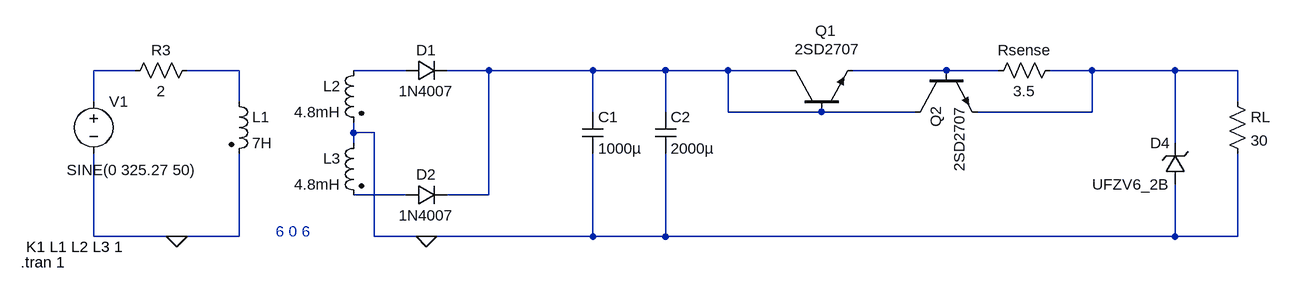
[diagram p0: schematic MP01_P.asc]
MP01_P.asc, the LTspice schematic file:
Version 4
SHEET 1 2204 680
WIRE 208 64 144 64
WIRE 368 64 288 64
WIRE 624 64 544 64
WIRE 752 64 688 64
WIRE 912 64 752 64
WIRE 1024 64 912 64
WIRE 1120 64 1024 64
WIRE 1216 64 1120 64
WIRE 1456 64 1312 64
WIRE 1536 64 1456 64
WIRE 1680 64 1616 64
WIRE 1808 64 1680 64
WIRE 1904 64 1808 64
WIRE 144 112 144 64
WIRE 368 112 368 64
WIRE 1904 112 1904 64
WIRE 912 128 912 64
WIRE 1024 128 1024 64
WIRE 1120 128 1120 64
WIRE 1264 128 1120 128
WIRE 1408 128 1264 128
WIRE 1680 128 1680 64
WIRE 1680 128 1504 128
WIRE 544 160 544 144
WIRE 576 160 544 160
WIRE 544 176 544 160
WIRE 1808 176 1808 64
WIRE 624 256 544 256
WIRE 752 256 752 64
WIRE 752 256 688 256
WIRE 144 320 144 192
WIRE 272 320 144 320
WIRE 368 320 368 192
WIRE 368 320 272 320
WIRE 576 320 576 160
WIRE 656 320 576 320
WIRE 912 320 912 192
WIRE 912 320 656 320
WIRE 1024 320 1024 192
WIRE 1024 320 912 320
WIRE 1808 320 1808 240
WIRE 1808 320 1024 320
WIRE 1904 320 1904 192
WIRE 1904 320 1808 320
FLAG 656 320 0
FLAG 272 320 0
SYMBOL voltage 144 96 R0
WINDOW 3 -41 121 Left 2
WINDOW 123 0 0 Left 0
WINDOW 39 -44 143 Left 2
SYMATTR Value SINE(0 325.27 50)
SYMATTR InstName V1
SYMBOL ind2 352 96 R0
SYMATTR InstName L1
SYMATTR Value 7H
SYMATTR Type ind
SYMBOL ind2 560 48 M0
SYMATTR InstName L2
SYMATTR Value 4.8mH
SYMATTR Type ind
SYMATTR SpiceLine Ipk=1
SYMBOL ind2 560 160 M0
SYMATTR InstName L3
SYMATTR Value 4.8mH
SYMATTR Type ind
SYMATTR SpiceLine Ipk=1
SYMBOL diode 624 80 R270
WINDOW 0 32 32 VTop 2
WINDOW 3 0 32 VBottom 2
SYMATTR InstName D1
SYMATTR Value 1N4007
SYMBOL diode 624 272 R270
WINDOW 0 32 32 VTop 2
WINDOW 3 0 32 VBottom 2
SYMATTR InstName D2
SYMATTR Value 1N4007
SYMBOL cap 896 128 R0
SYMATTR InstName C1
SYMATTR Value 1000µ
SYMATTR SpiceLine V=125 Irms=10.2 Rser=0.05 Lser=0
SYMBOL res 304 48 R90
WINDOW 0 0 56 VBottom 2
WINDOW 3 32 56 VTop 2
SYMATTR InstName R3
SYMATTR Value 2
SYMBOL res 1888 96 R0
SYMATTR InstName RL
SYMATTR Value 30
SYMBOL npn 1216 128 R270
WINDOW 0 125 38 VRight 2
WINDOW 3 97 7 VRight 2
SYMATTR InstName Q1
SYMATTR Value 2SD2707
SYMBOL npn 1408 64 M90
SYMATTR InstName Q2
SYMATTR Value 2SD2707
SYMBOL res 1632 48 R90
WINDOW 0 0 56 VBottom 2
WINDOW 3 32 56 VTop 2
SYMATTR InstName Rsense
SYMATTR Value 3.5
SYMBOL zener 1824 240 R180
WINDOW 0 24 64 Left 2
WINDOW 3 24 0 Left 2
SYMATTR InstName D4
SYMATTR Value UFZV6_2B
SYMATTR Description Diode
SYMATTR Type diode
SYMBOL cap 1008 128 R0
SYMATTR InstName C2
SYMATTR Value 2000µ
SYMATTR SpiceLine V=125 Irms=10.2 Rser=0.05 Lser=0
TEXT 40 336 Left 2 !K1 L1 L2 L3 1
TEXT 424 312 Left 2 ;6 0 6
TEXT 32 360 Left 2 !.tran 1

The netlist it stands for:
* MP01_P.asc
V1 N001 0 SINE(0 325.27 50)
L1 N002 0 7H
L2 N003 0 4.8mH Ipk=1
L3 0 N007 4.8mH Ipk=1
D1 N003 N004 1N4007
D2 N007 N004 1N4007
C1 N004 0 1000µ V=125 Irms=10.2 Rser=0.05 Lser=0
R3 N002 N001 2
RL N006 0 30
Q1 N004 N004 N005 0 2SD2707
Q2 N004 N005 N006 0 2SD2707
Rsense N006 N005 3.5
D4 0 N006 UFZV6_2B
C2 N004 0 2000µ V=125 Irms=10.2 Rser=0.05 Lser=0
.model D D
.lib standard.dio
.model NPN NPN
.model PNP PNP
.lib standard.bjt
K1 L1 L2 L3 1
* 6 0 6
.tran 1
.backanno
.end